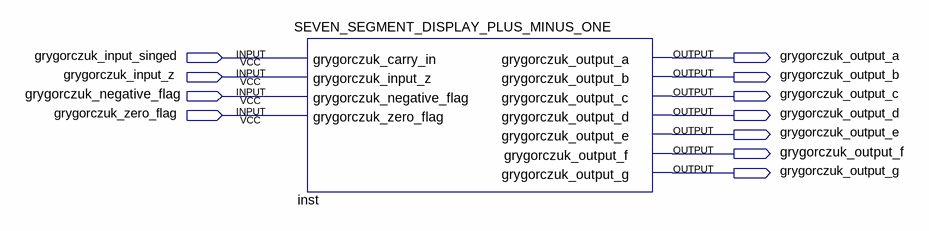
[diagram p0: schematic sheet]
// Quartus schematic SEVEN_SEGMENT_DISPLAY_PLUS_MINUS_ONE_SYMBOL.bdf as structural Verilog: 1 symbols, 11 pins
module SEVEN_SEGMENT_DISPLAY_PLUS_MINUS_ONE_SYMBOL (
  input  grygorczuk_input_singed,
  input  grygorczuk_input_z,
  input  grygorczuk_negative_flag,
  input  grygorczuk_zero_flag,
  output grygorczuk_output_a,
  output grygorczuk_output_b,
  output grygorczuk_output_c,
  output grygorczuk_output_d,
  output grygorczuk_output_e,
  output grygorczuk_output_f,
  output grygorczuk_output_g
);

  SEVEN_SEGMENT_DISPLAY_PLUS_MINUS_ONE inst (
    .grygorczuk_carry_in(grygorczuk_input_singed), .grygorczuk_input_z(grygorczuk_input_z),
    .grygorczuk_negative_flag(grygorczuk_negative_flag), .grygorczuk_zero_flag(grygorczuk_zero_flag),
    .grygorczuk_output_a(grygorczuk_output_a), .grygorczuk_output_b(grygorczuk_output_b),
    .grygorczuk_output_c(grygorczuk_output_c), .grygorczuk_output_d(grygorczuk_output_d),
    .grygorczuk_output_e(grygorczuk_output_e), .grygorczuk_output_f(grygorczuk_output_f),
    .grygorczuk_output_g(grygorczuk_output_g));
endmodule
